# Altium schematic sheet MS5803-01.BA.SchDoc: MS5803
size A4; DrawnBy: Hüseyin; Organization: Altium Limited; Address1: L3, 12a Rodborough Rd; Address2: Frenchs Forest; Address3: NSW; Address4: Australia 2086; Revision: 1; SheetNumber: 3; SheetTotal: 3
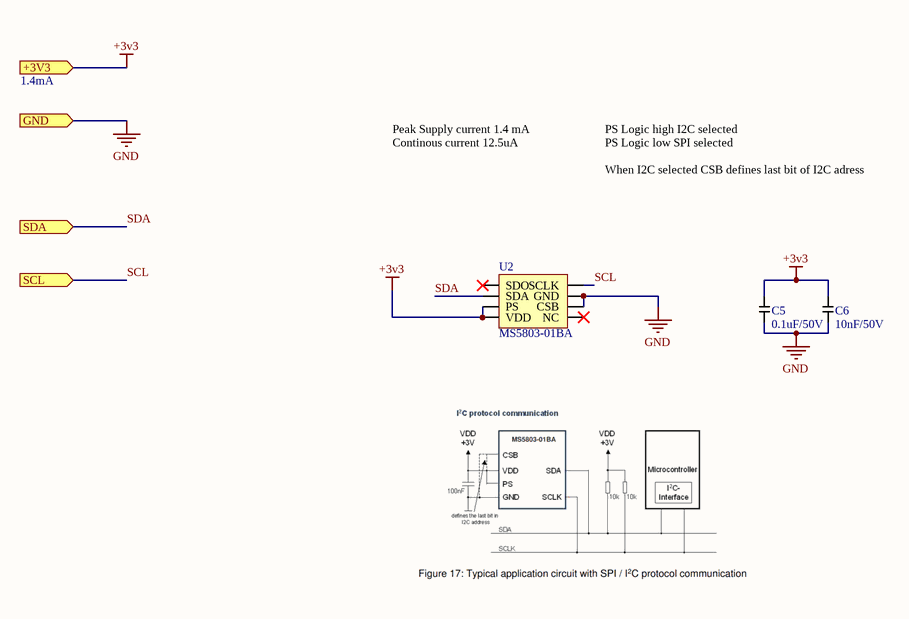
[diagram p0: MS5803-01.BA.SchDoc]

## Parts
C5  0.1uF/50V  [Cap_0805]
C6  10nF/50V  [Cap_0805]
U2  MS5803-01BA  [MS5803-01BA]

## Ports
+3V3 (in), GND (in), SCL (in), SDA (in)

## Nets
+3v3: C5.1 C6.2 U2.5(VDD) U2.6(PS) ; port +3V3
GND: C5.2 C6.1 U2.2(GND) U2.3(CSB) ; port GND
SCL: U2.1(SCLK) ; port SCL
SDA: U2.7(SDA) ; port SDA

Not connected (* = marked no-connect by the designer): U2 4(NC)* 8(SDO)*

## Notes on the sheet
- 1.4mA
- Peak Supply current 1.4 mA
  Continous current 12.5uA
- PS Logic high I2C selected
  PS Logic low SPI selected
  When I2C selected CSB defines last bit of I2C adress
- Size:
- Title
- A4
- DrawnBy
- Revision:
- YBU
- Batı Kampüsü
- Etlik Keçiören
- Date:
- Time:
- Sheet
- of
- Ankara / Türkiye

## Library data of the parts
C5 = CL21B104JBCNNNC: MLCC (2012) 0805 100nF 50VDC ±5% X7R; ComponentLink1Description: özdisan; ComponentLink1URL: CL21B104JBCNNNC
C6 = CL21B103KBANNNC: MLCC (2012) 0805 10nF 50VDC ±10% X7R; ComponentLink1Description: özdisan; ComponentLink1URL: https://ozdisan.com/Product/Detail/5607/CL21B103KBANNNC
U2 = MS5803-01BA: Pressure Sensor 0.15PSI ~ 18.85PSI (1kPa ~ 130kPa) Absolute 24 b 8-SMD Module